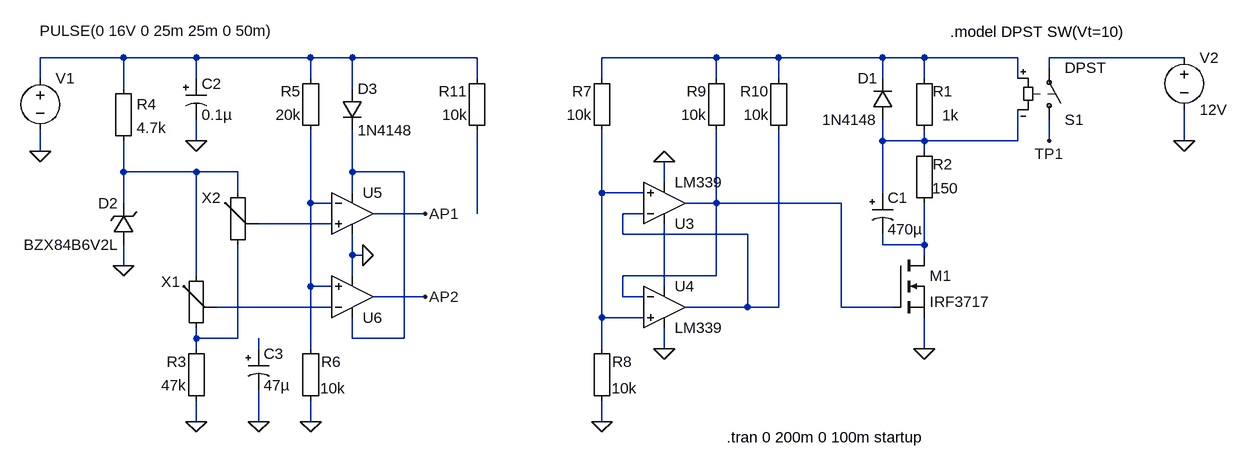
[diagram p0: schematic vin.asc]
vin.asc, the LTspice schematic file:
Version 4
SHEET 1 1560 680
WIRE -144 -112 -272 -112
WIRE -32 -112 -144 -112
WIRE 144 -112 -32 -112
WIRE 208 -112 144 -112
WIRE 400 -112 208 -112
WIRE 768 -112 592 -112
WIRE 864 -112 768 -112
WIRE 1024 -112 864 -112
WIRE 1088 -112 1024 -112
WIRE 1232 -112 1088 -112
WIRE 1488 -112 1280 -112
WIRE 1280 -96 1280 -112
WIRE -272 -80 -272 -112
WIRE -32 -80 -32 -112
WIRE 144 -80 144 -112
WIRE 400 -80 400 -112
WIRE 592 -80 592 -112
WIRE 768 -80 768 -112
WIRE 864 -80 864 -112
WIRE 1024 -80 1024 -112
WIRE 1088 -80 1088 -112
WIRE 1232 -80 1232 -112
WIRE -144 -64 -144 -112
WIRE 208 -64 208 -112
WIRE -32 16 -32 -16
WIRE 1024 16 1024 -16
WIRE 1088 16 1088 0
WIRE 1088 16 1024 16
WIRE 1232 16 1232 -32
WIRE 1232 16 1088 16
WIRE 1280 16 1280 -16
WIRE 1488 16 1488 -32
WIRE -272 32 -272 0
WIRE 1088 32 1088 16
WIRE -144 64 -144 16
WIRE -32 64 -144 64
WIRE 32 64 -32 64
WIRE 208 64 208 0
WIRE 288 64 208 64
WIRE 688 80 688 48
WIRE 32 96 32 64
WIRE 208 96 208 64
WIRE 592 96 592 0
WIRE 656 96 592 96
WIRE 1024 96 1024 16
WIRE -144 112 -144 64
WIRE 144 112 144 0
WIRE 176 112 144 112
WIRE 768 112 768 0
WIRE 768 112 720 112
WIRE 960 112 768 112
WIRE 320 128 240 128
WIRE 400 128 400 0
WIRE 656 128 624 128
WIRE 176 144 64 144
WIRE 624 160 624 128
WIRE 816 160 624 160
WIRE 1024 176 1024 160
WIRE 1088 176 1088 112
WIRE 1088 176 1024 176
WIRE 208 192 208 160
WIRE 224 192 208 192
WIRE 1088 192 1088 176
WIRE -144 208 -144 176
WIRE -32 224 -32 64
WIRE 208 224 208 192
WIRE 768 224 768 112
WIRE 768 224 624 224
WIRE 144 240 144 112
WIRE 176 240 144 240
WIRE 688 240 688 144
WIRE 320 256 240 256
WIRE 624 256 624 224
WIRE 656 256 624 256
WIRE 176 272 0 272
WIRE 816 272 816 160
WIRE 816 272 720 272
WIRE 864 272 864 0
WIRE 864 272 816 272
WIRE 960 272 960 112
WIRE 1040 272 960 272
WIRE 592 288 592 96
WIRE 656 288 592 288
WIRE -32 320 -32 304
WIRE 32 320 32 176
WIRE 32 320 -32 320
WIRE 208 320 208 288
WIRE 288 320 288 64
WIRE 288 320 208 320
WIRE -32 336 -32 320
WIRE 64 336 64 320
WIRE 144 336 144 240
WIRE 592 336 592 288
WIRE 688 336 688 304
WIRE 1088 336 1088 288
WIRE -32 448 -32 416
WIRE 64 448 64 400
WIRE 144 448 144 416
WIRE 592 448 592 416
FLAG -144 208 0
FLAG -32 16 0
FLAG 144 448 0
FLAG -32 448 0
FLAG -272 32 0
FLAG 64 448 0
FLAG 592 448 0
FLAG 688 336 0
FLAG 688 48 0
FLAG 1088 336 0
FLAG 1488 16 0
FLAG 1280 16 TP1
FLAG 320 128 AP1
FLAG 320 256 AP2
FLAG 224 192 0
SYMBOL Misc\\EuropeanResistor -16 432 R180
WINDOW 0 31 76 Left 2
WINDOW 3 31 40 Left 2
SYMATTR InstName R3
SYMATTR Value 47k
SYMBOL nmos 1040 192 R0
SYMATTR InstName M1
SYMATTR Value IRF3717
SYMBOL voltage -272 -96 R0
WINDOW 123 0 0 Left 2
WINDOW 39 0 0 Left 2
WINDOW 3 -1 -57 Left 2
SYMATTR Value PULSE(0 16V 0 25m 25m 0 50m)
SYMATTR InstName V1
SYMBOL pot -48 208 R0
WINDOW 0 -38 25 Left 2
SYMATTR InstName X1
SYMATTR SpiceLine R=100k Val=50
SYMBOL Misc\\EuropeanResistor -160 -80 R0
SYMATTR InstName R4
SYMATTR Value 4.7k
SYMBOL zener -128 176 R180
WINDOW 0 24 64 Left 2
WINDOW 3 24 0 Left 2
SYMATTR InstName D2
SYMATTR Value BZX84B6V2L
SYMATTR Description Diode
SYMATTR Type diode
SYMBOL polcap -48 -80 R0
SYMATTR InstName C2
SYMATTR Value 0.1µ
SYMBOL pot 16 80 R0
WINDOW 0 -40 24 Left 2
SYMATTR InstName X2
SYMATTR SpiceLine R=100k Val=50
SYMBOL Misc\\EuropeanResistor 160 16 R180
WINDOW 0 31 76 Left 2
WINDOW 3 31 40 Left 2
SYMATTR InstName R5
SYMATTR Value 20k
SYMBOL Misc\\EuropeanResistor 160 432 R180
WINDOW 0 -31 76 Left 2
WINDOW 3 -38 35 Left 2
SYMATTR InstName R6
SYMATTR Value 10k
SYMBOL polcap 48 336 R0
SYMATTR InstName C3
SYMATTR Value 47µ
SYMATTR SpiceLine V=16V
SYMBOL diode 192 -64 R0
SYMATTR InstName D3
SYMATTR Value 1N4148
SYMBOL Comparators\\LM339 688 176 M180
SYMATTR InstName U3
SYMBOL Comparators\\LM339 688 208 R0
SYMATTR InstName U4
SYMBOL Misc\\EuropeanResistor 608 16 R180
WINDOW 0 31 76 Left 2
WINDOW 3 31 40 Left 2
SYMATTR InstName R7
SYMATTR Value 10k
SYMBOL Misc\\EuropeanResistor 608 432 R180
WINDOW 0 -31 76 Left 2
WINDOW 3 -38 35 Left 2
SYMATTR InstName R8
SYMATTR Value 10k
SYMBOL Misc\\EuropeanResistor 784 16 R180
WINDOW 0 31 76 Left 2
WINDOW 3 31 40 Left 2
SYMATTR InstName R9
SYMATTR Value 10k
SYMBOL Misc\\EuropeanResistor 880 16 R180
WINDOW 0 31 76 Left 2
WINDOW 3 31 40 Left 2
SYMATTR InstName R10
SYMATTR Value 10k
SYMBOL polcap 1008 96 R0
SYMATTR InstName C1
SYMATTR Value 470µ
SYMATTR SpiceLine V=16V
SYMBOL Misc\\EuropeanResistor 1104 128 R180
WINDOW 0 -28 76 Left 2
WINDOW 3 -37 39 Left 2
SYMATTR InstName R2
SYMATTR Value 150
SYMBOL diode 1040 -16 R180
WINDOW 0 24 64 Left 2
WINDOW 3 24 0 Left 2
SYMATTR InstName D1
SYMATTR Value 1N4148
SYMBOL Misc\\EuropeanResistor 1104 16 R180
WINDOW 0 -28 76 Left 2
WINDOW 3 -37 39 Left 2
SYMATTR InstName R1
SYMATTR Value 1k
SYMBOL sw 1280 0 M180
SYMATTR InstName S1
SYMATTR Value DPST
SYMBOL voltage 1488 -128 R0
WINDOW 123 0 0 Left 2
WINDOW 39 0 0 Left 2
SYMATTR InstName V2
SYMATTR Value 12V
SYMBOL Misc\\EuropeanResistor 416 16 R180
WINDOW 0 31 76 Left 2
WINDOW 3 31 40 Left 2
SYMATTR InstName R11
SYMATTR Value 10k
SYMBOL Opamps\\UniversalOpamp2 208 128 R0
SYMATTR InstName U5
SYMBOL Opamps\\UniversalOpamp2 208 256 M180
SYMATTR InstName U6
TEXT 784 472 Left 2 !.tran 0 200m 0 100m startup
TEXT 1128 -152 Left 2 !.model DPST SW(Vt=10)

The netlist it stands for:
* vin.asc
R3 0 N016 47k
M1 N013 N009 0 0 IRF3717
V1 N001 0 PULSE(0 16V 0 25m 25m 0 50m)
XX1 N005 N015 N016 pot R=100k Val=50  ; pins 1 2 3
R4 N001 N005 4.7k
D2 0 N005 BZX84B6V2L
C2 N001 0 0.1µ
XX2 N005 N012 N016 pot R=100k Val=50  ; pins 1 2 3
R5 N008 N001 20k
R6 0 N008 10k
C3 N017 0 47µ V=16V
D3 N001 N006 1N4148
XU3 N007 N011 N014 0 N009 LM339  ; pins In+ In- V+ V- OUT
XU4 N007 N009 N014 0 N011 LM339  ; pins In+ In- V+ V- OUT
R7 N007 N002 10k
R8 0 N007 10k
R9 N009 N002 10k
R10 N011 N002 10k
C1 N004 N013 470µ V=16V
R2 N013 N004 150
D1 N004 N002 1N4148
R1 N004 N002 1k
S1 TP1 N003 N002 N004 DPST
V2 N003 0 12V
R11 N010 N001 10k
XU5 N012 N008 N006 0 AP1 level.2 Avol=1Meg GBW=10Meg Slew=10Meg ilimit=25m rail=0 Vos=0 phimargin=45 en=0 enk=0 in=0 ink=0 Rin=500Meg  ; pins IN+ IN- V+ V- OUT
XU6 N008 N015 N006 0 AP2 level.2 Avol=1Meg GBW=10Meg Slew=10Meg ilimit=25m rail=0 Vos=0 phimargin=45 en=0 enk=0 in=0 ink=0 Rin=500Meg  ; pins IN+ IN- V+ V- OUT
.model D D
.lib standard.dio
.model NMOS NMOS
.model PMOS PMOS
.lib standard.mos
.tran 0 200m 0 100m startup
.model DPST SW(Vt=10)
.lib LM339.sub
.lib UniversalOpamps2.sub
.backanno
.end